# Altium project EC_meter.PrjPcb
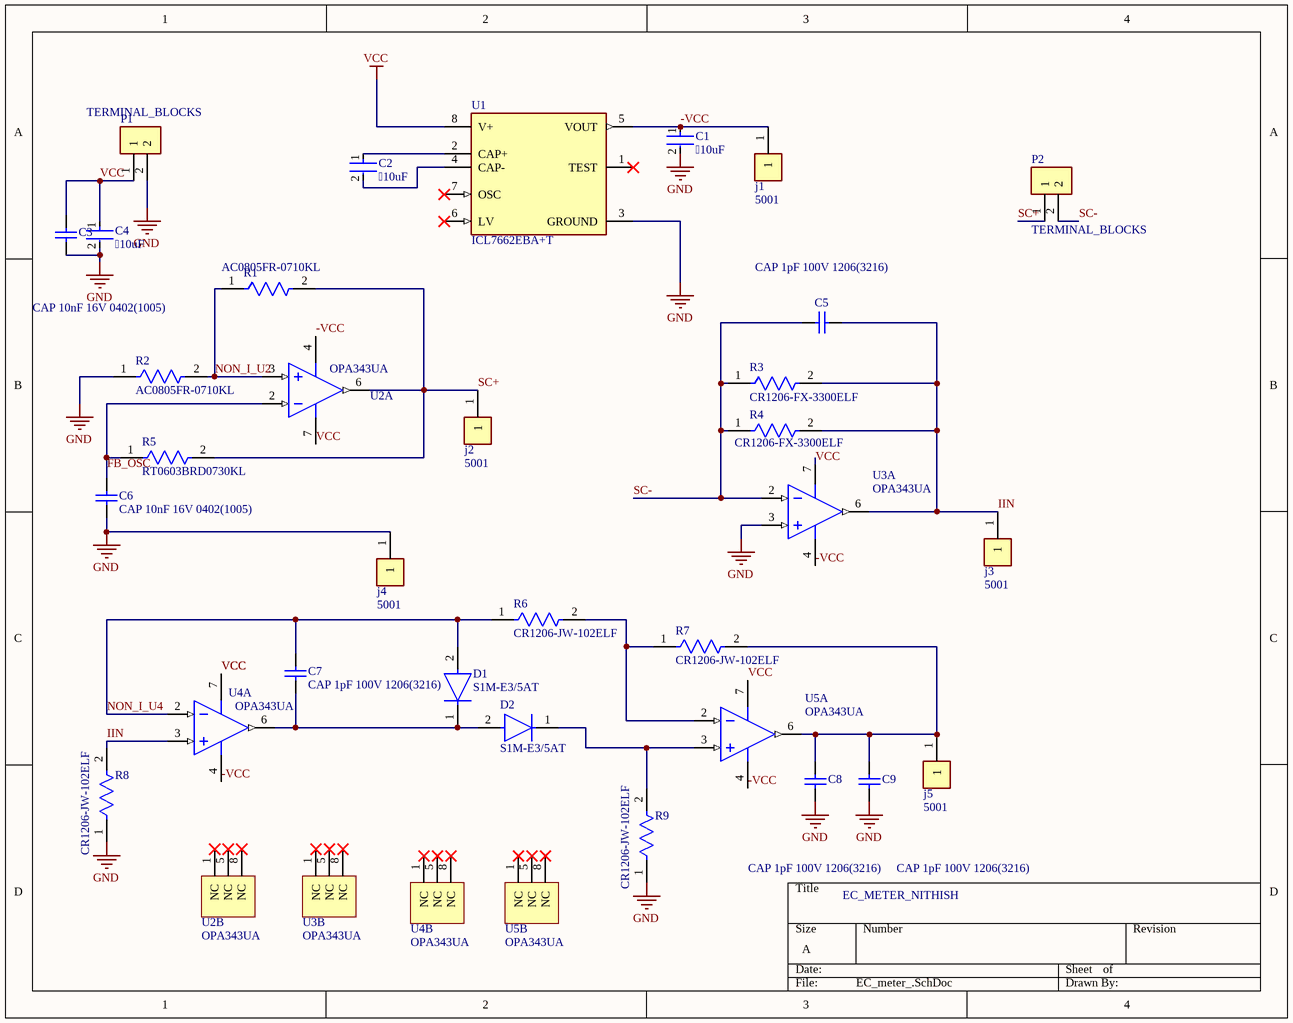
[diagram p0: EC_meter_.SchDoc]
1 sheet, 32 parts. Net scope: global (net labels, ports and power ports of the same name join across sheets).
Board file: EC_meter.PcbDoc

## Sheet EC_meter_.SchDoc
size A; SheetNumber: 1; SheetTotal: 1

### Parts
C1  10uF  [FP-GRM31-0_2-MFG]
C2  10uF  [FP-GRM31-0_2-MFG]
C3  CAP 10nF 16V 0402(1005)  [CAPC0402(1005)60_M]
C4  10uF  [FP-GRM31-0_2-MFG]
C5  CAP 1pF 100V 1206(3216)  [CAPC1206(3216)170_N]
C6  CAP 10nF 16V 0402(1005)  [CAPC0402(1005)60_M]
C7  CAP 1pF 100V 1206(3216)  [CAPC1206(3216)170_N]
C8  CAP 1pF 100V 1206(3216)  [CAPC1206(3216)170_N]
C9  CAP 1pF 100V 1206(3216)  [CAPC1206(3216)170_N]
D1  S1M-E3/5AT  [FP-95400-MFG]
D2  S1M-E3/5AT  [FP-95400-MFG]
j1  5001  [FP-5001-MFG]
j2  5001  [FP-5001-MFG]
j3  5001  [FP-5001-MFG]
j4  5001  [FP-5001-MFG]
j5  5001  [FP-5001-MFG]
P1  TERMINAL_BLOCKS  [PCBComponent_1 - duplicate]
P2  TERMINAL_BLOCKS  [PCBComponent_1 - duplicate]
R1  AC0805FR-0710KL  [FP-AC0805-MFG]
R2  AC0805FR-0710KL  [FP-AC0805-MFG]
R3  CR1206-FX-3300ELF  [FP-CR1206-MFG]
R4  CR1206-FX-3300ELF  [FP-CR1206-MFG]
R5  RT0603BRD0730KL  [FP-RT0603-0_55-MFG]
R6  CR1206-JW-102ELF  [FP-CR1206-IPC_C]
R7  CR1206-JW-102ELF  [FP-CR1206-IPC_C]
R8  CR1206-JW-102ELF  [FP-CR1206-IPC_C]
R9  CR1206-JW-102ELF  [FP-CR1206-IPC_C]
U1  ICL7662EBA+T  [FP-S8-4-MFG]
U2  OPA343UA  [D0008A_M]  (parts A,B of 2)
U3  OPA343UA  [D0008A_M]  (parts A,B of 2)
U4  OPA343UA  [D0008A_M]  (parts A,B of 2)
U5  OPA343UA  [D0008A_M]  (parts A,B of 2)

### Nets
GND: C1.2 C3.1 C4.2 C6.1 C8.1 C9.1 j4.1 P1.2 R2.1 R8.1 R9.1 U1.3(GROUND) U3.3(IN+)
VCC: C3.2 C4.1 P1.1 U1.8(V+) U2.7(V+) U3.7(V+) U4.7(V+) U5.7(V+)
-VCC: C1.1 j1.1 U1.5(VOUT) U2.4(V-) U3.4(V-) U4.4(V-) U5.4(V-)
FB_OSC: C6.2 R5.1 U2.2(IN-)
IIN: C5.1 j3.1 R3.2 R4.2 R8.2 U3.6(OUT) U4.3(IN+)
NON_I_U2: R1.1 R2.2 U2.3(IN+)
NON_I_U4: C7.2 D1.2(A) R6.1 U4.2(IN-)
SC+: j2.1 P2.1 R1.2 R5.2 U2.6(OUT)
SC-: C5.2 P2.2 R3.1 R4.1 U3.2(IN-)
NetC2_1: C2.1 U1.2(CAP+)
NetC2_2: C2.2 U1.4(CAP-)
NetC7_1: C7.1 D1.1(C) D2.2(A) U4.6(OUT)
NetC8_2: C8.2 C9.2 j5.1 R7.2 U5.6(OUT)
NetD2_1: D2.1(C) R9.2 U5.3(IN+)
NetR6_2: R6.2 R7.1 U5.2(IN-)

Not connected (* = marked no-connect by the designer): U1 1(TEST)* 6(LV)* 7(OSC)*; U2 1(NC)* 5(NC)* 8(NC)*; U3 1(NC)* 5(NC)* 8(NC)*; U4 1(NC)* 5(NC)* 8(NC)*; U5 1(NC)* 5(NC)* 8(NC)*

### Notes on the sheet
- EC_METER_NITHISH

### Library data of the parts
C1 C2 C4 = CMP-2000-05256-2: CAP CER 10UF 50V X5R 1206; Manufacturer: Murata Electronics North America; Manufacturer Part Number: GRM31CR61H106KA12L; Tolerance: 10%; Temperature Coefficient: 15%; Material: Ceramic; Height: 1.8mm; Temperature: -55°C to +85°C; Lead Free: Yes; Temperature Characteristic: X5R; ComponentLink2Description: Datasheet; Digikey Description: CAP CER 10UF 50V X5R 1206; Octopart: https://octopart.com/grm31cr61h106ka12l-murata-18903335; Device Class L2: Capacitors; Automotive: No; Value: 10uF; Temperature Range High: +85°C; Temperature Range Low: -55°C; Device Class L3: Ceramic Capacitors; Voltage Rating: 50V; Capacitance: 10uF; Device Class L1: Passive Components; Mouser Description: Multilayer Ceramic Capacitors MLCC - SMD/SMT 1206 10uF 50volt X5R +/-10%; ComponentLink2URL: https://search.murata.co.jp/Ceramy/image/img/A01X/G101/ENG/GRM31CR61H106KA12-01A.pdf; Package: GRM31-0.2; RoHS: TRUE; Category: Cap
C3 C6 = CMP-1034-01878-1: CAP 10nF 16V -20% to +80% 0402 (1005 Metric) Thickness 0.6mm SMD; Case-Metric: 1005; Case-EIA: 0402; Rated Voltage: 16 V; Max Thickness: 0.6 mm; Tolerance: -20% to +80%; Value: 10nF; Technology: SMT
C5 C7-C9 = CMP-1037-00028-1: CAP 1pF 100V ±0.25pF 1206 (3216 Metric) Thickness 1.7mm SMD; Case-Metric: 3216; Tolerance: Â±0.25pF; Case-EIA: 1206; Rated Voltage: 100 V; Max Thickness: 1.7 mm; Value: 1pF; Technology: SMT
D1 D2 = CMP-02540-000018-1: DIODE GEN PURP 1KV 1A DO214AC; Manufacturer: Vishay; Value: 12pF; Max Repetitive Reverse Voltage: 1000V; Max Surge Forward Current: 30A; Peak Reverse Current: 5uA; Max Junction Temp: +150°C; Standoff Height: 0mm; Category: Diode; Temperature: -55°C to +150°C; Digikey Description: DIODE GEN PURP 1KV 1A DO214AC; Lead Free: Yes; Device Class L1: Discrete Semiconductors; Height: 2.29mm; Package: 95400; RoHS: TRUE; Capacitance: 12pF; ComponentLink2URL: http://www.vishay.com/docs/88711/s1.pdf; Mouser Description: Rectifiers 1.0 Amp 1000 Volt 30A IFSM @ 8.3ms; Octopart: https://octopart.com/s1m-e3%2F5at-vishay-42334588; Device Class L3: Rectifier Diodes; Forward Current: 1A; Automotive: No; Footprint Url: http://www.vishay.com/docs/95400/sma.pdf; ComponentLink2Description: Datasheet; Manufacturer Part Number: S1M-E3/5AT; Temperature Range Low: -55°C; Temperature Range High: +150°C; Device Class L2: Diodes
j1-j5 = CMP-2000-05181-2: PC TEST POINT MINIATURE BLACK; Body Material: Bronze; Plating: Silver; Inside Diameter: 1.27mm; Hole Diameter: 1.6mm; Number of Ports: 1; Outside Diameter: 2.54mm; Insulation: Insulated; Insulation Material: Nylon; Mount: Through Hole; RoHS Compliant: Yes; Series: THM; Height: 0.3inch; Termination: Through Hole; Material: Nylon; Packaging: Bulk; Contact Material: Bronze; REACH SVHC: No SVHC; Contact Plating: Silver; Orientation: Straight; Lead Free: Lead Free; Package Quantity: 100; Length: 7.62mm; Flammability Rating: UL94 V-0; Number of Contacts: 1; Diameter: 2.54mm; Housing Color: Black; Color: Black
R1 R2 = CMP-2001-04480-2: RES SMD 10K OHM 1% 1/8W 0805; Manufacturer: Yageo; Voltage Rating: 150V; Automotive Grade: Grade 0; Resistance: 10KΩ; Value: 10KΩ; Tolerance: 0.01; Temperature: -55°C to +155°C; Device Class L2: Resistors; RoHS: TRUE; Octopart: https://octopart.com/ac0805fr-0710kl-yageo-21711112; Ipc Land Pattern Name: RESC200125X50; Manufacturer Part Number: AC0805FR-0710KL; ComponentLink2Description: Datasheet; Footprint Url: http://www.yageo.com/exep/pages/download/literatures/PYu-R_Mount_10.pdf; Temperature Range High: +155°C; Digikey Description: RES SMD 10K OHM 1% 1/8W 0805; Package: AC0805; Automotive: Yes; Mouser Description: Res Thick Film 0805 10K Ohm 1% 0.125W(1/8W) ±100ppm/C Epoxy Pad SMD Automotive T/R; Series: AC; ComponentLink2URL: http://www.yageo.com/documents/recent/PYu-AC_51_RoHS_L_6.pdf; Composition: Thick Film; Device Class L3: Chip SMD Resistors; Temperature Range Low: -55°C; Power Rating: 1/8W; Device Class L1: Passive Components; Height: 0.6mm; Lead Free: Yes; Category: Res
R3 R4 = CMP-07231-003158-1: Thick Film Chip Resistors 1206 330Ω 0.25W 1% 100ppm/°C; Voltage Rating: 200V; Max Power Dissipation: 250mW; Resistance: 330R; Radiation Hardening: No; Length: 3.2mm; Number of Pins: 2; Composition: Thick Film; Tolerance: 1%; Case Code (Metric): 3216; Max Operating Temperature: 155°C; Number of Terminations: 2; Package Quantity: 5000; Temperature Coefficient: 100ppm/°C; Termination: SMD/SMT; Min Operating Temperature: -55°C; Military Standard: Not; Case/Package: 1206; Packaging: Tape and Reel; Case Code (Imperial): 1206; Contact Plating: Tin; Voltage Rating (DC): 200V; REACH SVHC: No SVHC; Height: 0.6mm; Thickness: 610um; Mount: Surface Mount; Depth: 1.6mm; Power Rating: 250mW; Width: 1.6mm
R5 = CMP-2000-04435-3: NexarPartId: 1243756; Voltage Rating: 75V; Tolerance: 0.1%; Voltage Rating (DC): 50V; Power Rating: 100mW; Resistance: 30kΩ; Temperature Coefficient: 25ppm/°C; Min Operating Temperature: -55°C; Height: 550µm; Military Standard: Not; RoHS: Compliant; Length: 1.6mm; Contact Plating: Tin; Case/Package: 0603; Max Operating Temperature: 125°C; Depth: 800µm; Width: 787.4µm; Weight: 2.012816mg; Features: Moisture Resistant; Case Code (Metric): 1608; Lead Free: Lead Free; Schedule B: 8533210045, 8533210045; Number of Terminations: 2; Max Power Dissipation: 100mW; Termination: SMD/SMT; Case Code (Imperial): 0603; Radiation Hardening: No; Composition: Thin Film
R6-R9 = CMP-07231-001820-1: Thick Film Chip Resistors 1206 1kΩ 0.25W 5% 200ppm/°C; Voltage Rating: 200V; Resistance: 1kR; Power Rating: 250mW; Number of Pins: 2; Packaging: Tape and Reel; Termination: SMD/SMT; Case Code (Imperial): 1206; Radiation Hardening: No; Height: 0.6mm; Temperature Coefficient: 200ppm/°C; Mount: Surface Mount; Case Code (Metric): 3216; Case/Package: 1206; Thickness: 610um; Voltage Rating (DC): 200V; Military Standard: Not; Width: 1.6mm; Min Operating Temperature: -55°C; Length: 3.2mm; Depth: 1.6mm; REACH SVHC: No SVHC; Contact Plating: Tin; Tolerance: 5%; Package Quantity: 5000; Composition: Thick Film; Max Operating Temperature: 155°C
U1 = CMP-05722-000128-1: IC REG CHARGE PUMP INV 8SOIC; Manufacturer: Maxim; Nominal Supply Current: 20-250uA; Output Voltage: -20/+40V; Number Of Outputs: 1; Switching Frequency: 10kHz; Max Supply Voltage: 20V; Min Supply Voltage: 4.5V; Negative Voltage Available: true; Output Type: Fixed; Max Power Dissipation: 500mW; Standoff Height: 0.1mm; Output Current: 20mA; Switching Topology: Charge Pump; RoHS: TRUE; Lead Free: Yes; Device Class L2: Power Management ICs; Temperature: -40°C to +85°C; Temperature Range Low: -40°C; ComponentLink2URL: https://datasheets.maximintegrated.com/en/ds/ICL7662-Si7661.pdf; Digikey Description: IC REG CHARGE PUMP INV 8SOIC; Device Class L3: Voltage Regulators - Switching; Automotive: No; Octopart: https://octopart.com/icl7662eba%2Bt-maxim+integrated-39621878; Category: IC; Footprint Url: https://pdfserv.maximintegrated.com/land_patterns/90-0096.PDF; Manufacturer Part Number: ICL7662EBA+T; Mouser Description: Switching Voltage Regulators CMOS Voltage Converter; Device Class L1: Integrated Circuits (ICs); ComponentLink2Description: Datasheet; Height: 1.75mm; Package: S8-4; Temperature Range High: +85°C
U2-U5 = CMP-0272-00349-3: Single-Supply, Rail-to-Rail Operational Amplifier MicroAmplifier(TM) Series, 2.5 to 5.5 V, -40 to 85 degC, 8-pin SOIC (D8), Green (RoHS & no Sb/Br); Manufacturer: Texas Instruments; Slew Rate(Typ)(V/us): 6; Iq per channel(Max)(mA): 1.25; CMRR(Min)(dB): 74; Total Supply Voltage(Min)(+5V is 5, +/-5V is 10): 2.5; Rating: Catalog; IIB(Max)(pA): 10; Total Supply Voltage(Max)(+5V is 5, +/-5V is 10): 5.5; Sub Family: High Output Current Amplifier (>=50mA), Low Input Bias Current Amp (<=10pA), Low Supply Voltage Amplifier (<=2.7V), Precision Amplifier; Packing: TUBE; Vio (25C)(Max)(mV): 8; Number of Channels: 1; Offset Drift(Typ)(uV/C): 3; ComponentLink2Description: Datasheet; Mounting Technology: Surface Mount; DatasheetVersion: SBOS090A; PackageDescription: 8-Pin Plastic Small Outline, Body 4.9 x 3.9 mm, Pitch 1.27 mm; ComponentLink1URL: http://www.ti.com/; ComponentLink3Description: Package Specification; PackageReference: D0008A; ComponentLink2URL: http://www.ti.com/lit/ds/symlink/opa343.pdf; ComponentLink3URL: http://www.ti.com/litv/pdf/msoi002j; Eco-Plan: Green (RoHS & no Sb/Br); PackageVersion: 4040047-3/M, 06/2011; PartNumber: OPA343UA; GBW(Typ)(MHz): 5.5; ComponentLink1Description: Manufacturer URL; Code_JEDEC: MS-012